# Altium schematic sheet LCD TFT 40 Pin.SchDoc
size A; SheetNumber: 6; SheetTotal: 10
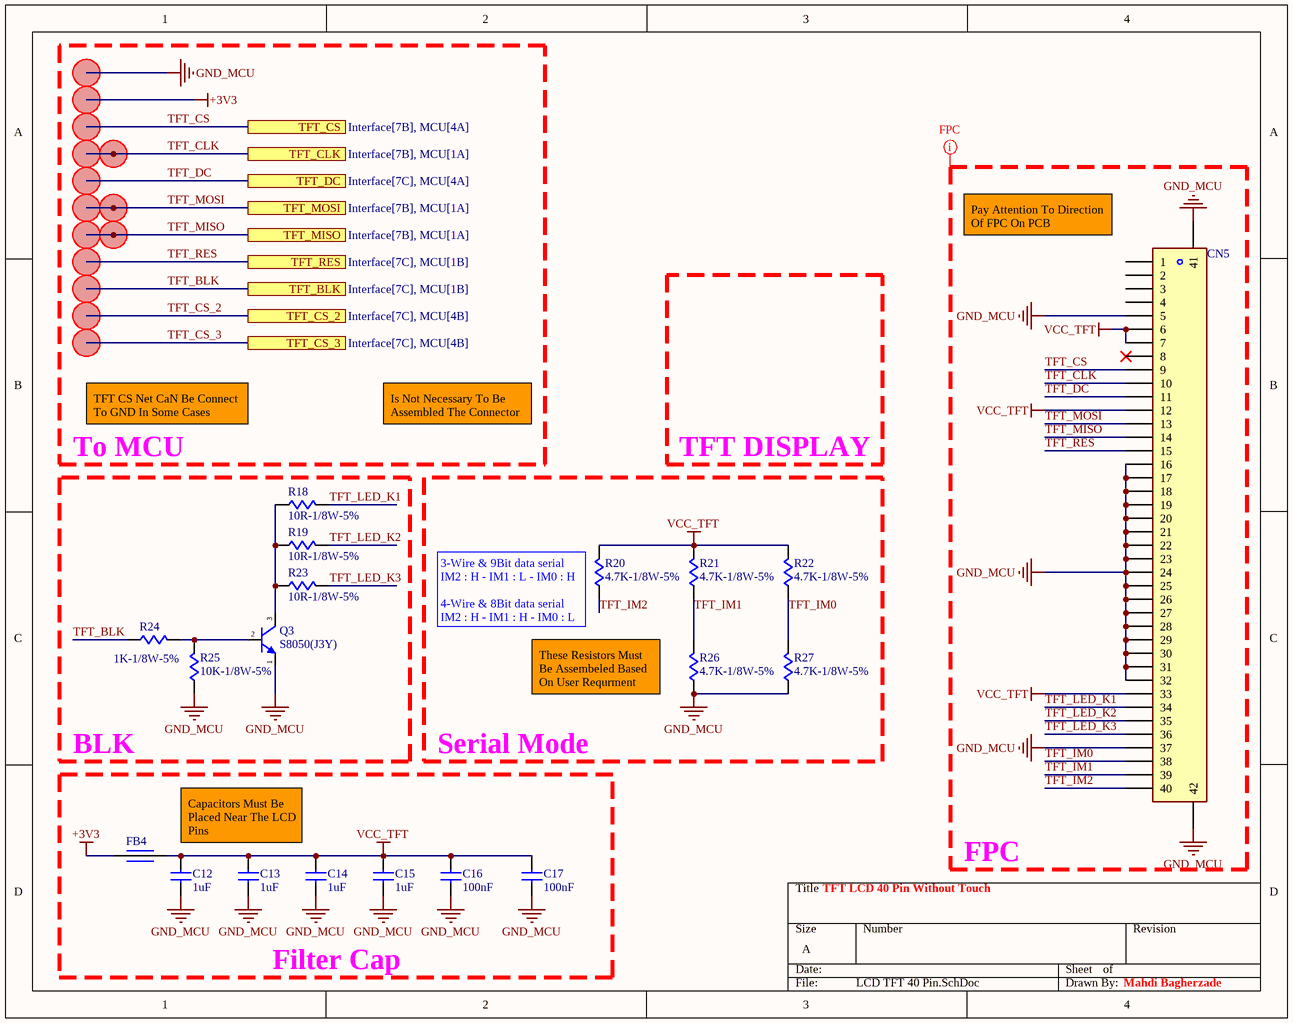
[diagram p0: LCD TFT 40 Pin.SchDoc]

## Parts
C12  value 1uF  [C-0805]  (hidden comment: CAP Cer 1uF-50V-X7R-SMD)
C13  value 1uF  [C-0805]  (hidden comment: CAP Cer 1uF-50V-X7R-SMD)
C14  value 1uF  [C-0805]  (hidden comment: CAP Cer 1uF-50V-X7R-SMD)
C15  value 1uF  [C-0805]  (hidden comment: CAP Cer 1uF-50V-X7R-SMD)
C16  value 100nF  [C-0805]  (hidden comment: CAP Cer 100nF-50V-X7R-SMD)
C17  value 100nF  [C-0805]  (hidden comment: CAP Cer 100nF-50V-X7R-SMD)
CN5  0.5mm-Horizontal  [CN-FPC-40-0.5mm-hor]  (value not drawn)
FB4  FERRITE BEAD  [FB-0805]  (value not drawn)
Q3  S8050(J3Y)  [SOT23-213]
R18  10R-1/8W-5%  [R-0805]
R19  10R-1/8W-5%  [R-0805]
R20  4.7K-1/8W-5%  [R-0805]
R21  4.7K-1/8W-5%  [R-0805]
R22  4.7K-1/8W-5%  [R-0805]
R23  10R-1/8W-5%  [R-0805]
R24  1K-1/8W-5%  [R-0805]
R25  10K-1/8W-5%  [R-0805]
R26  4.7K-1/8W-5%  [R-0805]
R27  4.7K-1/8W-5%  [R-0805]
TP1  (no value)  [TEST POINT-DIP]  (net tie, no BOM)
TP2  (no value)  [TEST POINT-DIP]  (net tie, no BOM)
TP3  (no value)  [TEST POINT-DIP]  (net tie, no BOM)
TP4  (no value)  [TEST POINT-DIP]  (net tie, no BOM)
TP5  (no value)  [TEST POINT-DIP]  (net tie, no BOM)
TP6  (no value)  [TEST POINT-DIP]  (net tie, no BOM)
TP7  (no value)  [TEST POINT-DIP]  (net tie, no BOM)
TP8  (no value)  [TEST POINT-DIP]  (net tie, no BOM)
TP9  (no value)  [TEST POINT-DIP]  (net tie, no BOM)
TP10  (no value)  [TEST POINT-DIP]  (net tie, no BOM)
TP11  (no value)  [TEST POINT-DIP]  (net tie, no BOM)
TP12  (no value)  [TEST POINT-DIP]  (net tie, no BOM)
TP13  (no value)  [TEST POINT-DIP]  (net tie, no BOM)
TP14  (no value)  [TEST POINT-DIP]  (net tie, no BOM)

## Blocks framed on the sheet
To MCU: TP1-TP14

## Ports
TFT_BLK (see Interface[7C], MCU[1B]), TFT_CLK (see Interface[7B], MCU[1A]), TFT_CS (see Interface[7B], MCU[4A]), TFT_CS_2 (see Interface[7C], MCU[4B]), TFT_CS_3 (see Interface[7C], MCU[4B]), TFT_DC (see Interface[7C], MCU[4A]), TFT_MISO (see Interface[7B], MCU[1A]), TFT_MOSI (see Interface[7B], MCU[1A]), TFT_RES (see Interface[7C], MCU[1B])

## Nets
+3V3: FB4.1 TP2.1(TP)
GND_MCU: C12.2 C13.2 C14.2 C15.2 C16.2 C17.2 CN5.5 CN5.16 CN5.17 CN5.18 CN5.19 CN5.20 CN5.21 CN5.22 CN5.23 CN5.24 CN5.25 CN5.26 CN5.27 CN5.28 CN5.29 CN5.30 CN5.31 CN5.32 CN5.37 CN5.41 CN5.42 Q3.1(E) R25.1 R26.1 R27.1 TP1.1(TP)
VCC_TFT: C12.1 C13.1 C14.1 C15.1 C16.1 C17.1 CN5.6 CN5.7 CN5.12 CN5.33 FB4.2 R20.2 R21.2 R22.2
TFT_BLK: R24.1 TP9.1(TP) ; port TFT_BLK
TFT_CLK: CN5.10 TP4.1(TP) TP10.1(TP) ; port TFT_CLK
TFT_CS: CN5.9 TP3.1(TP) ; port TFT_CS
TFT_CS_2: TP13.1(TP) ; port TFT_CS_2
TFT_CS_3: TP14.1(TP) ; port TFT_CS_3
TFT_DC: CN5.11 TP5.1(TP) ; port TFT_DC
TFT_IM0: CN5.38 R22.1 R27.2
TFT_IM1: CN5.39 R21.1 R26.2
TFT_IM2: CN5.40 R20.1
TFT_LED_K1: CN5.34 R18.2
TFT_LED_K2: CN5.35 R19.2
TFT_LED_K3: CN5.36 R23.2
TFT_MISO: CN5.14 TP7.1(TP) TP12.1(TP) ; port TFT_MISO
TFT_MOSI: CN5.13 TP6.1(TP) TP11.1(TP) ; port TFT_MOSI
TFT_RES: CN5.15 TP8.1(TP) ; port TFT_RES
NetQ3_2: Q3.2(B) R24.2 R25.2
NetQ3_3: Q3.3(C) R18.1 R19.1 R23.1

Not connected (* = marked no-connect by the designer): CN5 1 2 3 4 8*

## Layout directives
net class FPC: GND_MCU, TFT_CLK, TFT_CS, TFT_DC, TFT_IM0, TFT_IM1, TFT_IM2, TFT_LED_K1, TFT_LED_K2, TFT_LED_K3, TFT_MISO, TFT_MOSI, TFT_RES, VCC_TFT

## Notes on the sheet
- (near CN5) Pay Attention To Direction Of FPC On PCB
- (near TP14) TFT CS Net CaN Be Connect To GND In Some Cases
- Is Not Necessary To Be Assembled The Connector
- TFT DISPLAY
- (near R20) 3-Wire & 9Bit data serial
  IM2 : H - IM1 : L - IM0 : H
  4-Wire & 8Bit data serial
  IM2 : H - IM1 : H - IM0 : L
- These Resistors Must Be Assembeled Based On User Requrment
- BLK
- Serial Mode
- Capacitors Must Be Placed Near The LCD Pins
- TFT LCD 40 Pin Without Touch
- FPC
- Filter Cap
- Mahdi Bagherzade

## Library data of the parts
C12-C17 = CAP-CER: CAPACITOR; Phone Number: 0915 8700 314; Voltage: 50V; Tolerance: X7R; Type: SMD; Publisher: Mahdi Bagherzadeh; ComponentLink1Description: Linkedin; ComponentLink1URL: https://ir.linkedin.com/in/mahdi-bagherzade; Published Date: 9-15-2024
CN5 = CN-FPC-40pin: CONNECTOR; Phone Number: 0915 8700 314; Publisher: Mahdi Bagherzadeh; ComponentLink1Description: Linkedin; ComponentLink1URL: https://ir.linkedin.com/in/mahdi-bagherzade; Published Date: 9-15-2024
FB4 = FERRITE BEAD: INDUCATOR; Phone Number: 0915 8700 314; Publisher: Mahdi Bagherzadeh; ComponentLink1Description: Linkedin; ComponentLink1URL: https://ir.linkedin.com/in/mahdi-bagherzade; Published Date: 9-15-2024
Q3 = S8050: TRANSISTOR; Phone Number: 0915 8700 314; Publisher: Mahdi Bagherzadeh; ComponentLink1Description: Linkedin; ComponentLink1URL: https://ir.linkedin.com/in/mahdi-bagherzade; Published Date: 9-15-2024
R18-R27 = RES: RESISTOR; Phone Number: 0915 8700 314; Publisher: Mahdi Bagherzadeh; ComponentLink1Description: Linkedin; ComponentLink1URL: https://ir.linkedin.com/in/mahdi-bagherzade; Published Date: 9-15-2024
TP1-TP14 = TEST PIONT: Phone Number: 0915 8700 314; Publisher: Mahdi Bagherzadeh; ComponentLink1Description: Linkedin; ComponentLink1URL: https://ir.linkedin.com/in/mahdi-bagherzade; Published Date: 9-15-2024